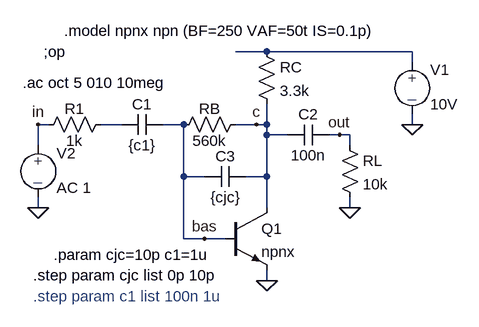
[diagram p0: schematic q1-e-schaltung-rb.asc]
q1-e-schaltung-rb.asc, the LTspice schematic file:
Version 4
SHEET 1 880 680
WIRE 224 48 176 48
WIRE 448 48 224 48
WIRE 448 64 448 48
WIRE -112 160 -128 160
WIRE 0 160 -32 160
WIRE 96 160 64 160
WIRE 208 160 176 160
WIRE 224 160 224 128
WIRE 224 160 208 160
WIRE 448 160 448 144
WIRE 224 176 224 160
WIRE 256 176 224 176
WIRE 336 176 320 176
WIRE 352 176 336 176
WIRE -128 192 -128 160
WIRE 352 192 352 176
WIRE 96 240 96 160
WIRE 128 240 96 240
WIRE 224 240 224 176
WIRE 224 240 192 240
WIRE -128 288 -128 272
WIRE 224 288 224 240
WIRE 352 288 352 272
WIRE 96 336 96 240
WIRE 128 336 96 336
WIRE 160 336 128 336
WIRE 224 400 224 384
FLAG 448 160 0
FLAG 352 288 0
FLAG -128 288 0
FLAG 336 176 out
FLAG 128 336 bas
FLAG -128 160 in
FLAG 224 400 0
FLAG 208 160 c
SYMBOL EIT_Semiconductors\\npn 160 288 R0
SYMATTR InstName Q1
SYMATTR Value npnx
SYMBOL source-V 448 48 R0
SYMATTR InstName V1
SYMATTR Value 10V
SYMBOL res 192 144 R90
WINDOW 0 7 56 VBottom 2
WINDOW 3 25 56 VTop 2
SYMATTR InstName RB
SYMATTR Value 560k
SYMBOL res 336 176 R0
SYMATTR InstName RL
SYMATTR Value 10k
SYMBOL cap 256 192 R270
WINDOW 0 32 32 VTop 2
WINDOW 3 0 32 VBottom 2
SYMATTR InstName C2
SYMATTR Value 100n
SYMBOL cap 0 176 R270
WINDOW 0 32 32 VTop 2
WINDOW 3 0 32 VBottom 2
SYMATTR InstName C1
SYMATTR Value {c1}
SYMBOL res -128 176 R270
WINDOW 0 25 56 VTop 2
WINDOW 3 7 56 VBottom 2
SYMATTR InstName R1
SYMATTR Value 1k
SYMBOL source-V -128 176 R0
SYMATTR InstName V2
SYMATTR Value AC 1
SYMBOL res 208 32 R0
SYMATTR InstName RC
SYMATTR Value 3.3k
SYMBOL cap 192 224 R90
WINDOW 0 0 32 VBottom 2
WINDOW 3 32 32 VTop 2
SYMATTR InstName C3
SYMATTR Value {cjc}
TEXT -88 16 Left 2 !.model npnx npn (BF=250 VAF=50t IS=0.1p)
TEXT -120 48 Left 2 !;op
TEXT -152 96 Left 2 !.ac oct 5 010 10meg
TEXT -104 360 Left 2 !.param cjc=10p c1=1u
TEXT -136 392 Left 2 !.step param cjc list 0p 10p
TEXT -136 424 Left 2 ;.step param c1 list 100n 1u

The netlist it stands for:
* q1-e-schaltung-rb.asc
Q1 c bas 0 0 npnx
V1 N001 0 10V
RB c bas 560k
RL out 0 10k
C2 c out 100n
C1 N002 bas {c1}
R1 in N002 1k
V2 in 0 AC 1
RC N001 c 3.3k
C3 c bas {cjc}
.model NPN NPN
.model PNP PNP
.lib standard.bjt
.model npnx npn (BF=250 VAF=50t IS=0.1p)
;op
.ac oct 5 010 10meg
.param cjc=10p c1=1u
.step param cjc list 0p 10p
* .step param c1 list 100n 1u
.backanno
.end